# Altium project motor_driver499.PrjPcb
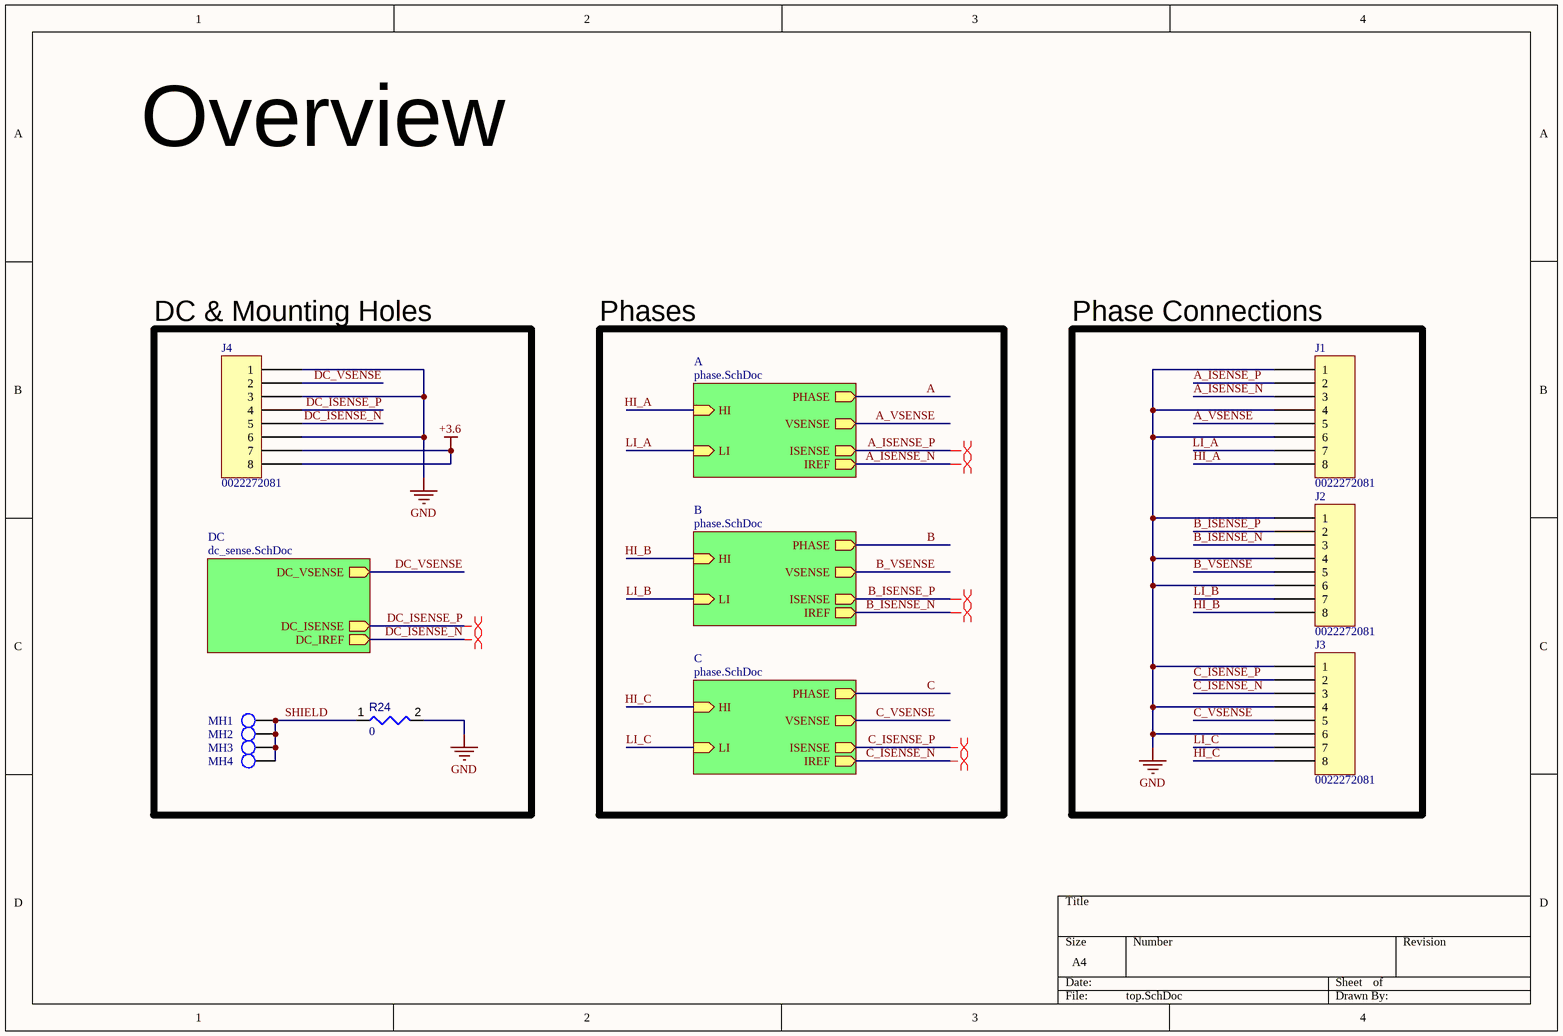
[diagram p0: top.SchDoc]
3 sheets, 121 parts. Net scope: hierarchical (ports join the sheet entries above them; power ports are global).
Board file: prototype_v1.PcbDoc
Sheets:
  top.SchDoc
    B = phase.SchDoc
    C = phase.SchDoc
    A = phase.SchDoc
    DC = dc_sense.SchDoc

## Sheet top.SchDoc
size A4; SheetNumber: 1; SheetTotal: 3

### Parts
J1  0022272081  [MOLEX KK 0022272081]
J2  0022272081  [MOLEX KK 0022272081]
J3  0022272081  [MOLEX KK 0022272081]
J4  0022272081  [MOLEX KK 0022272081]
MH1  Mounting Hole M2.5-Plated  [Copy of Mounting Hole 6-32-Footprint-1]  (value not drawn)
MH2  Mounting Hole M2.5-Plated  [Copy of Mounting Hole 6-32-Footprint-1]  (value not drawn)
MH3  Mounting Hole M2.5-Plated  [Copy of Mounting Hole 6-32-Footprint-1]  (value not drawn)
MH4  Mounting Hole M2.5-Plated  [Copy of Mounting Hole 6-32-Footprint-1]  (value not drawn)
R24  value 0  [RESC0603(1608)_L]  (hidden comment: 0R3J)

### Blocks framed on the sheet
DC & Mounting Holes: J4 MH1-MH4 R24
Phase Connections: J1-J3

### Sub-sheets
A = phase.SchDoc: HI (in), LI (in), PHASE (out), VSENSE (out), ISENSE (out), IREF (out)
B = phase.SchDoc: HI (in), LI (in), PHASE (out), VSENSE (out), ISENSE (out), IREF (out)
C = phase.SchDoc: HI (in), LI (in), PHASE (out), VSENSE (out), ISENSE (out), IREF (out)
DC = dc_sense.SchDoc: DC_VSENSE (out), DC_ISENSE (out), DC_IREF (out)

### Nets
+3.6: J4.7 J4.8
GND: J1.1 J1.4 J1.6 J2.1 J2.4 J2.6 J3.1 J3.4 J3.6 J4.1 J4.3 J4.6 R24.2
A_ISENSE_N: J1.3 ; sheet A/IREF
A_ISENSE_P: J1.2 ; sheet A/ISENSE
A_VSENSE: J1.5 ; sheet A/VSENSE
B_ISENSE_N: J2.3 ; sheet B/IREF
B_ISENSE_P: J2.2 ; sheet B/ISENSE
B_VSENSE: J2.5 ; sheet B/VSENSE
C_ISENSE_N: J3.3 ; sheet C/IREF
C_ISENSE_P: J3.2 ; sheet C/ISENSE
C_VSENSE: J3.5 ; sheet C/VSENSE
DC_ISENSE_N: J4.5 ; sheet DC/DC_IREF
DC_ISENSE_P: J4.4 ; sheet DC/DC_ISENSE  [project net DC_ISENSE]
DC_VSENSE: J4.2 ; sheet DC/DC_VSENSE
HI_A: J1.8 ; sheet A/HI
HI_B: J2.8 ; sheet B/HI
HI_C: J3.8 ; sheet C/HI
LI_A: J1.7 ; sheet A/LI
LI_B: J2.7 ; sheet B/LI
LI_C: J3.7 ; sheet C/LI
SHIELD: MH1.1 MH2.1 MH3.1 MH4.1 R24.1

### Layout directives
differential pair: A_ISENSE_N, A_ISENSE_P, B_ISENSE_N, B_ISENSE_P, C_ISENSE_N, C_ISENSE_P, DC_ISENSE, DC_ISENSE_N

### Notes on the sheet
- Overview
- Phases

### Library data of the parts
J1-J4 = CMP-002-00675-1: CONN HEADER VERT 8POS 2.54MM; Manufacturer: Molex; Contact Length - Mating: 0.295" (7.49mm); Contact Length - Post: 0.140" (3.56mm); Shrouding: Shrouded - 1 Wall; Style: Board to Cable/Wire; Number of Positions Loaded: All; Number of Positions: 8; Pitch - Mating: 0.100" (2.54mm); Overall Contact Length: 0.560" (14.22mm); Material Flammability Rating: UL94 V-0; Insulation Height: 0.461" (11.70mm); LastUpdated: 1/12/2020 11:52:41 PM; Connector Type: Header; ComponentLink2Description: DigiKey Link; ComponentLink2URL: http://digikey.com/product-detail/en/molex/0022272081/WM4117-ND/1130583; Part Number: 0022272081; Part Status: Active; ComponentLink1Description: Datasheet; Lifecycle Status: Active; PartId: 82; Contact Finish Thickness - Mating: 100.0µin (2.54µm); Number of Rows: 1; Series: KK 6410; Termination: Solder; Fastening Type: Friction Lock; Insulation Material: Polyamide (PA), Nylon; Contact Shape: Square; Minimum Order: 1; Packaging: Bulk; Price: 0.60; Insulation Color: Natural; Contact Type: Male Pin; Contact Material: Brass; Mounting Type: Through Hole; ComponentLink1URL: https://www.molex.com/pdm_docs/sd/022272081_sd.pdf; Contact Finish - Mating: Tin; Contact Finish - Post: Tin
MH1-MH4 = CMP-00028-00010-2
R24 = CMP-009-00063-2: Jumper 0603 (1608 Metric); Case/Package: 0603; Mounting Technology: SMT; Pins: 2

## Sheet phase.SchDoc
size A3; SheetNumber: 2; SheetTotal: 3
Used 3 times, as channels B, C, A. Parts and nets are listed once, with the designators drawn on the sheet.
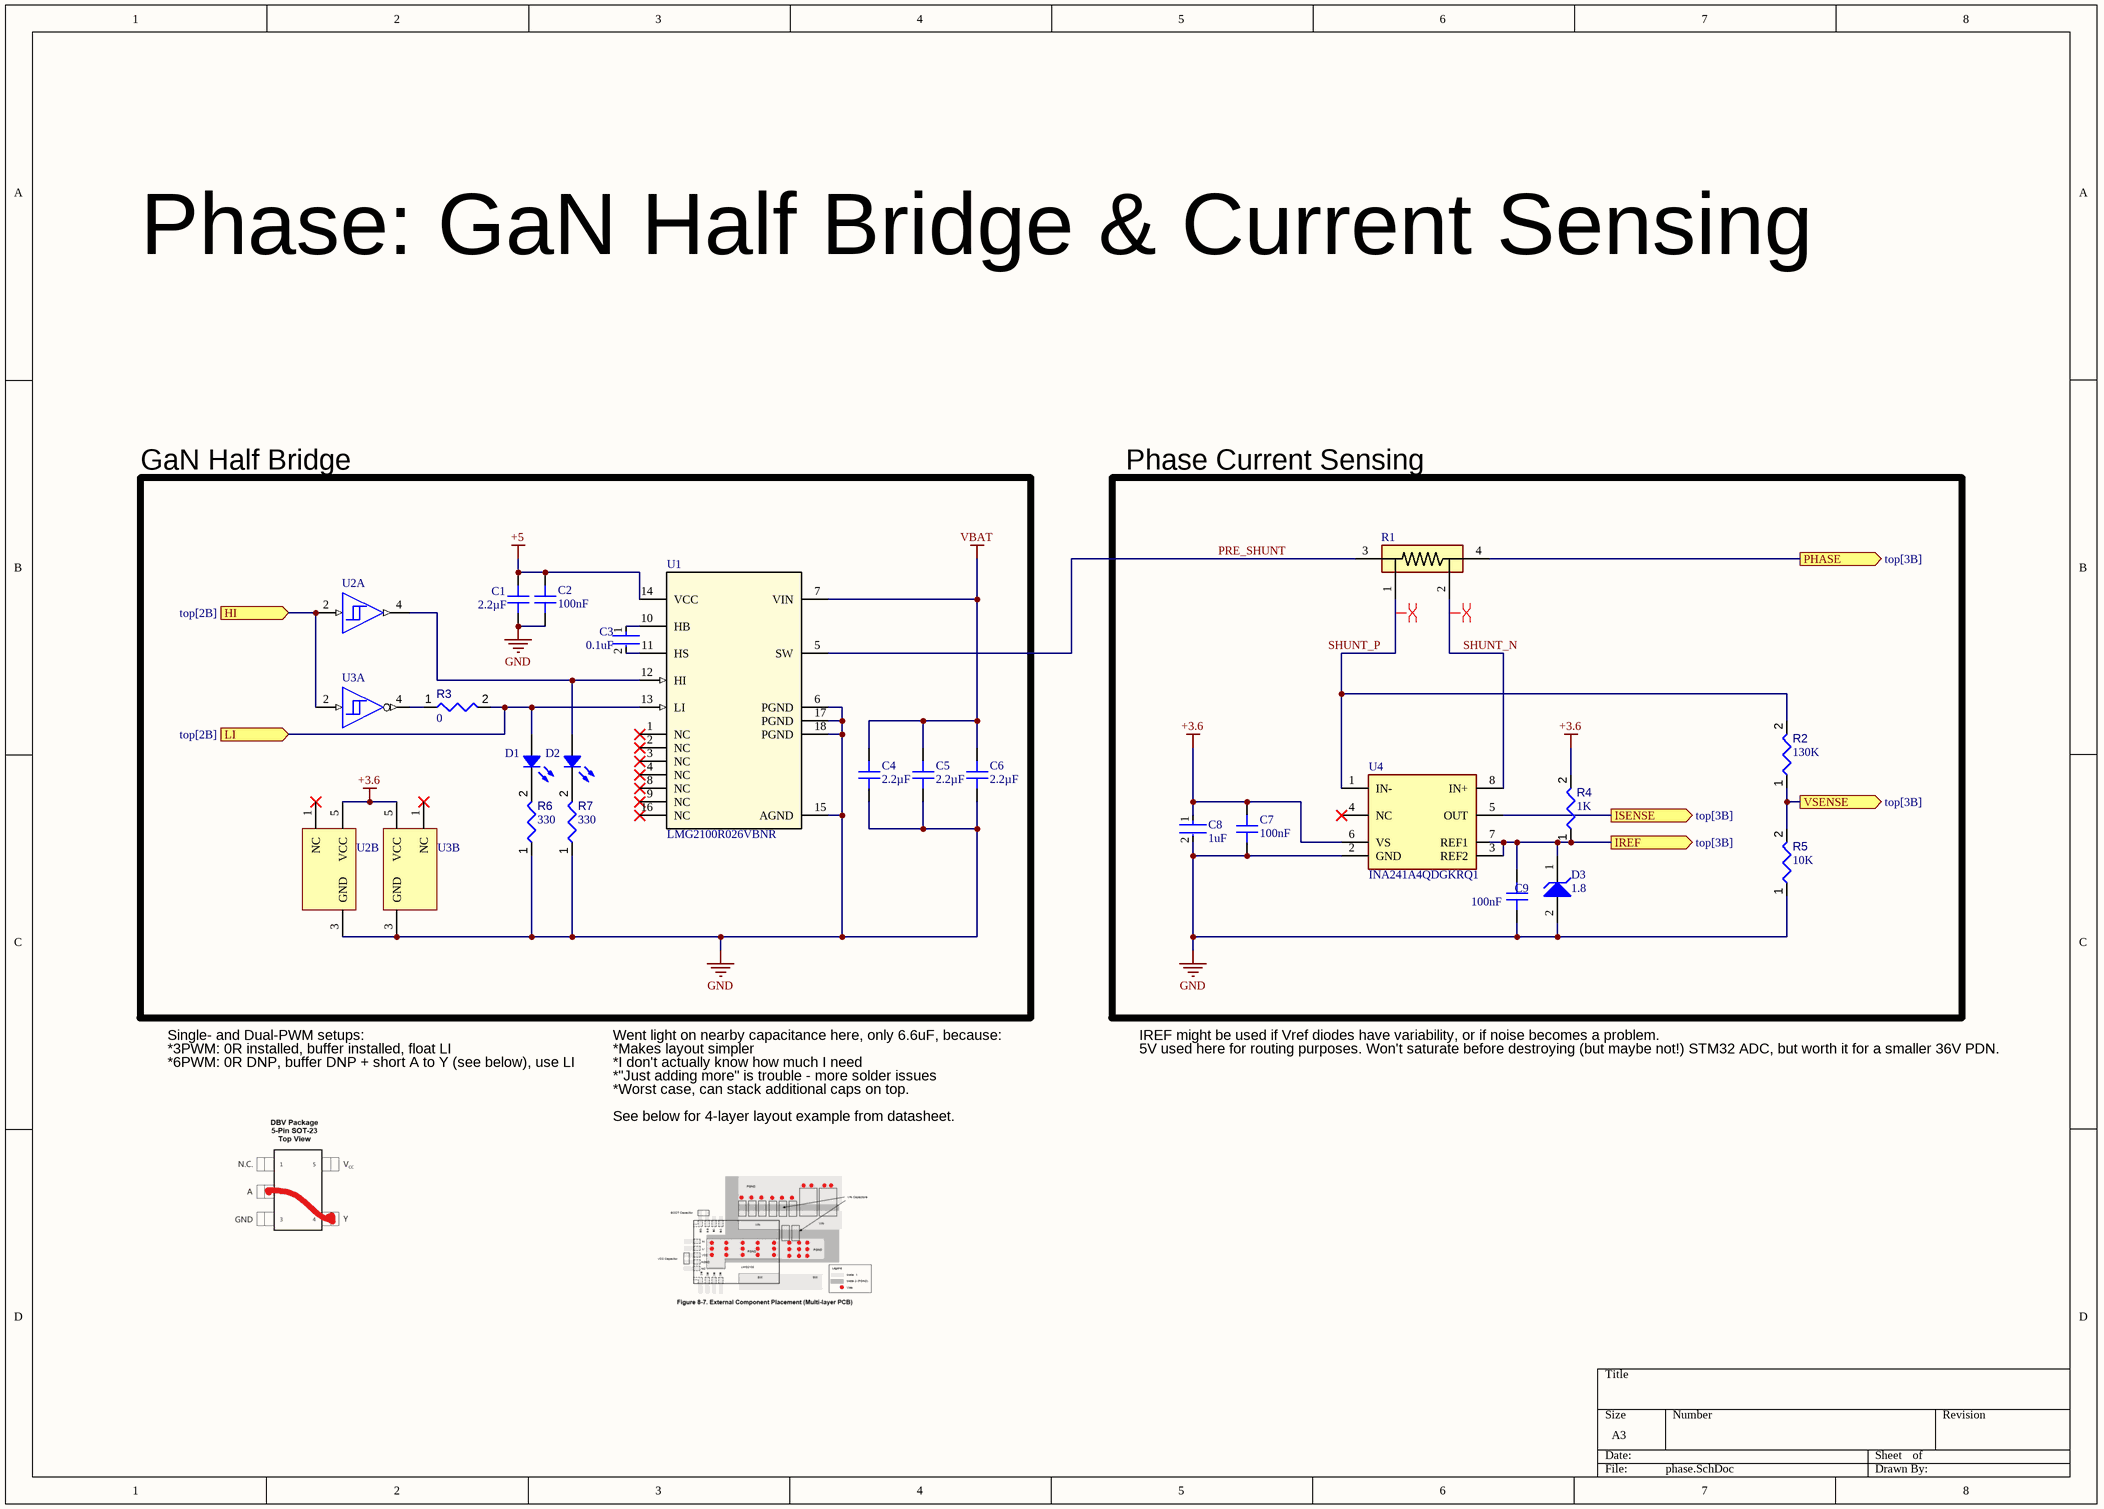
[diagram p1: phase.SchDoc]

### Parts
C1  value 2.2µF  [CAP 0603_1608]  (hidden comment: KGM15BR51C225KM)
C2  value 100nF  [CAPC0402(1005)33_L]  (hidden comment: CL05B104KO5NNNC)
C3  0.1uF  [FP-GRM155-0_05-MFG]
C4  value 2.2µF  [MURATA GRM21B 0805_2012]  (hidden comment: GRM21BD72A225ME01K)
C5  value 2.2µF  [MURATA GRM21B 0805_2012]  (hidden comment: GRM21BD72A225ME01K)
C6  value 2.2µF  [MURATA GRM21B 0805_2012]  (hidden comment: GRM21BD72A225ME01K)
C7  value 100nF  [CAPC0402(1005)33_L]  (hidden comment: CL05B104KO5NNNC)
C8  1uF  [FP-GRM155-0_05-MFG]
C9  value 100nF  [CAPC0402(1005)33_L]  (hidden comment: CL05B104KO5NNNC)
D1  150060BS55040  [LED 0603_1608 BLUE]  (value not drawn)
D2  150060BS55040  [LED 0603_1608 BLUE]  (value not drawn)
D3  VZ Typ (V): 1.8  [ONSC-SOD-123-2-425-04_V]  (hidden comment: SZMMSZ4678T1G)
R1  PU2726FKMPD0U3L  [PU2726FKMPD0U3L]  (value not drawn)
R2  value 130K  [RESC0603(1608)_L]  (hidden comment: 120R3J)
R3  value 0  [RESC0603(1608)_L]  (hidden comment: 0R3J)
R4  value 1K  [RESC0603(1608)_L]  (hidden comment: 120R3J)
R5  value 10K  [RESC0603(1608)_L]  (hidden comment: 120R3J)
R6  value 330  [RESC0603(1608)_L]  (hidden comment: 120R3J)
R7  value 330  [RESC0603(1608)_L]  (hidden comment: 120R3J)
U1  LMG2100R026VBNR  [VBN0018A-MFG]
U2  SN74AUP1G17DBVT  [DBV0005A_N]  (value not drawn)  (parts A,B of 2)
U3  SN74LVC1G14MDBVREP  [DBV0005A_N]  (value not drawn)  (parts A,B of 2)
U4  INA241A4QDGKRQ1  [SOIC127P600X175-8N]

### Blocks framed on the sheet
GaN Half Bridge: C1-C6 D1 D2 R3 R6 R7 U1-U3
Phase Current Sensing: C7-C9 D3 R1 R2 R4 R5 U4

### Ports
HI (in, see top[2B]), IREF (out, see top[3B]), ISENSE (out, see top[3B]), LI (in, see top[2B]), PHASE (out, see top[3B]), VSENSE (out, see top[3B])

### Nets
+3.6: C7.2 C8.1 R4.2 U2.5(VCC) U3.5(VCC) U4.6(VS)
+5: C1.2 C2.2 U1.14(VCC)
GND: C1.1 C2.1 C4.1 C5.1 C6.1 C7.1 C8.2 C9.1 D3.2(A) R5.1 R6.1 R7.1 U1.6(PGND) U1.15(AGND) U1.17(PGND) U1.18(PGND) U2.3(GND) U3.3(GND) U4.2(GND)
VBAT: C4.2 C5.2 C6.2 U1.7(VIN)
HI: U2.2(A) U3.2(A) ; port HI
IREF: C9.2 D3.1(K) R4.1 U4.3(REF2) U4.7(REF1) ; port IREF
ISENSE: U4.5(OUT) ; port ISENSE
LI: D1.1 R3.2 U1.13(LI) ; port LI
PHASE: R1.4 ; port PHASE
PRE_SHUNT: R1.3 U1.5(SW)
SHUNT_N: R1.2 U4.8(IN+)
SHUNT_P: R1.1 R2.2 U4.1(IN-)
VSENSE: R2.1 R5.2 ; port VSENSE
NetC3_1: C3.1 U1.10(HB)
NetC3_2: C3.2 U1.11(HS)
NetD1_2: D1.2 R6.2
NetD2_1: D2.1 U1.12(HI) U2.4(Y)
NetD2_2: D2.2 R7.2
NetR3_1: R3.1 U3.4(Y)

Not connected (* = marked no-connect by the designer): U1 1(NC)* 2(NC)* 3(NC)* 4(NC)* 8(NC)* 9(NC)* 16(NC)*; U2 1(NC)*; U3 1(NC)*; U4 4(NC)*

### Channels
B: designators end in _B; ports HI=HI_B IREF=B_ISENSE_N ISENSE=B_ISENSE_P LI=LI_B PHASE=B VSENSE=B_VSENSE
C: designators end in _C; ports HI=HI_C IREF=C_ISENSE_N ISENSE=C_ISENSE_P LI=LI_C PHASE=C VSENSE=C_VSENSE
A: designators end in _A; ports HI=HI_A IREF=A_ISENSE_N ISENSE=A_ISENSE_P LI=LI_A PHASE=A VSENSE=A_VSENSE

### Layout directives
differential pair: SHUNT_N_B, SHUNT_P_B

### Notes on the sheet
- Phase: GaN Half Bridge & Current Sensing
- Single- and Dual-PWM setups:
- *3PWM: 0R installed, buffer installed, float LI
- Went light on nearby capacitance here, only 6.6uF, because:
- *Makes layout simpler
- IREF might be used if Vref diodes have variability, or if noise becomes a problem.
- 5V used here for routing purposes. Won't saturate before destroying (but maybe not!) STM32 ADC, but worth it for a smaller 36V PDN.
- *6PWM: 0R DNP, buffer DNP + short A to Y (see below), use LI
- *I don't actually know how much I need
- *"Just adding more" is trouble - more solder issues
- *Worst case, can stack additional caps on top.
- See below for 4-layer layout example from datasheet.

### Library data of the parts
C1 = CMP-001-48803-2: CAP CER 2.2UF 16V X5R 0603; manufacturer: KYOCERA AVX; Tolerance: 10%; Part Number: KGM15BR51C225KM; series: KGM - X5R; lastupdated: 2/9/2024 8:09:11 PM; Size / Dimension: 0.063" L x 0.031" W (1.60mm x 0.80mm); ComponentLink2Description: DigiKey Link; Operating Temperature: -55°C ~ 85°C; ComponentLink1URL: https://datasheets.kyocera-avx.com/cx5r.pdf; Mounting Type: Surface Mount, MLCC; Part Status: Active; ComponentLink1Description: Datasheet; partid: 53097; Lifecycle Status: Active; price: 0.04; Device Package: 0603 (1608 Metric); Thickness (Max): 0.037" (0.95mm); Case/Package: 0603 (1608 Metric); packaging: TapeAndReel; Applications: General Purpose; ComponentLink2URL: https://www.digikey.com/en/products/detail/kyocera-avx/KGM15BR51C225KM/9749268; Temperature Coefficient: X5R; Voltage - Rated: 16V; Minimum Order: 1
C2 C7 C9 = CMP-001-35390-2: CAP CER 0.1UF 16V X7R 0402; manufacturer: Samsung Electro-Mechanics; Tolerance: 10%; ComponentLink2URL: https://www.digikey.com/en/products/detail/samsung-electro-mechanics/CL05B104KO5NNNC/3886659; Lifecycle Status: Active; lastupdated: 2/9/2024 8:04:31 PM; price: 0.01; Case/Package: 0402 (1005 Metric); series: CL; Mounting Type: Surface Mount, MLCC; ComponentLink1URL: http://www.samsungsem.com/kr/support/product-search/mlcc/CL05B104KO5NNNC.jsp; ComponentLink2Description: DigiKey Link; Part Status: Active; Part Number: CL05B104KO5NNNC; Thickness (Max): 0.022" (0.55mm); packaging: CutTape; Temperature Coefficient: X7R; Applications: General Purpose; Voltage - Rated: 16V; Device Package: 0402 (1005 Metric); Size / Dimension: 0.039" L x 0.020" W (1.00mm x 0.50mm); ComponentLink1Description: Datasheet; Operating Temperature: -55°C ~ 125°C; Minimum Order: 1; partid: 6066
C3 C8 = CMP-06035-012136-1: Chip Multilayer Ceramic Capacitors for General Purpose, 0402, 1.0uF, B, 10%, 20%, 16V
C4-C6 = CMP-001-56417-1: CAP CER 2.2UF 100V X7T 0805; manufacturer: Murata Electronics; Tolerance: 20%; Size / Dimension: 0.079" L x 0.049" W (2.00mm x 1.25mm); Lifecycle Status: Active; Voltage - Rated: 100V; ComponentLink1Description: Datasheet; Operating Temperature: -55°C ~ 125°C; partid: 45172; Applications: General Purpose; Thickness (Max): 0.057" (1.45mm); Temperature Coefficient: X7T; Part Number: GRM21BD72A225ME01K; price: 0.08; ComponentLink2URL: https://www.digikey.com/en/products/detail/murata-electronics/GRM21BD72A225ME01K/15972575; Mounting Type: Surface Mount, MLCC; packaging: TapeAndReel; lastupdated: 8/27/2024 9:29:54 AM; Case/Package: 0805 (2012 Metric); Minimum Order: 1; series: GRM; ComponentLink1URL: https://search.murata.co.jp/Ceramy/image/img/A01X/G101/ENG/GRM21BD72A225ME01-01A.pdf; Part Status: Active; ComponentLink2Description: DigiKey Link; Device Package: 0805 (2012 Metric)
D1 D2 = CMP-004-14535-2: LED BLUE DIFFUSED 0603 SMD; Manufacturer: Würth Elektronik; Current - Test: 20mA; Voltage - Forward (Vf) (Typ): 3.2V; Configuration: Standard; Lens Color: 0.50mm; Lens Style: Rectangle with Flat Top; Millicandela Rating: 80mcd; Lens Size: 1.00mm x 0.80mm; Viewing Angle: 140°; Wavelength - Peak: 465nm; Wavelength - Dominant: 470nm; LastUpdated: 6/3/2024 7:57:52 PM; Part Number: 150060BS55040; Color: Blue; Device Package: 0603 (1608 Metric); Lifecycle Status: Active; PartId: 796; Size / Dimension: 1.60mm L x 0.80mm W; Part Status: Active; ComponentLink1Description: Datasheet; Value: Blue; ComponentLink2URL: https://www.digikey.com/en/products/detail/würth-elektronik/150060BS55040/8557178; Height (Max): 0.50mm; ComponentLink1URL: https://www.we-online.de/web/en/index.php/download/media/07_electronic_components/download_center_1/application_notes_berichte/ano002_leds___the_future_of_horticultural_lighting/ANO002b_EN_LEDs_The_Future_of_Horticultural_Lighting.pdf; Series: WL-SMCD; Lens Transparency: Diffused; Case/Package: 0603 (1608 Metric); Mounting Type: Surface Mount; Packaging: TapeAndReel; Supplier Device Package: 0603 (1608 Metric); Price: 0.11; Minimum Order: 1; ComponentLink2Description: DigiKey Link
D3 = CMP-1060-00510-1: Zener Voltage Regulator, 500 mW, 2-Pin SOD-123, Pb-Free, Tape and Reel; Manufacturer: On Semiconductor; P Max (W): 0.5; PartNumber: SZMMSZ4678T1G; PackageDescription: 2-Pin SOD, Body 1.6 x 2.69 mm; Mounting Technology: Surface Mount; ComponentLink2URL: http://www.onsemi.com/pub_link/Collateral/MMSZ4678T1-D.PDF; ComponentLink1URL: http://www.onsemi.com/; DatasheetVersion: Rev. 9; PackageVersion: Rev. G, 10/2009; ComponentLink3Description: Package Specification; ComponentLink2Description: Datasheet; Packing: Tape and Reel; ComponentLink3URL: http://www.onsemi.com/pub_link/Collateral/425-04.PDF; RoHS: Pb-Free; PackageReference: SOD-123-2-425-04; ComponentLink1Description: Manufacturer URL
R1 = CMP-1021-000000-2: Thick Film Resistors - SMD 0.3mOhms 11W 2726 1% 75ppm Shunt AEC-Q200; Manufacturer_Name: Yageo Group; Geometry.Height: 3.7mm; Mouser Part Number: *; Datasheet Link: https://www.yageogroup.com/content/datasheet/asset/file/PYU-PU2726_ROHS_L; Arrow Price/Stock: *; Mouser Price/Stock: *; Manufacturer_Part_Number: PU2726FKMPD0U3L; Arrow Part Number: *; Source: PU2726FKMPD0U3L.SchLib; Design Item ID: PU2726FKMPD0U3L
R2 R4-R7 = CMP-009-00069-2: 120R 0.1W 5% 0603 (1608 Metric)  SMD; Power: 100mW; Mounting Technology: SMT; Tolerance: 5%; Case/Package: 0603; Pins: 2
R3 = CMP-009-00063-2: Jumper 0603 (1608 Metric); Case/Package: 0603; Mounting Technology: SMT; Pins: 2
U1 = CMP-1018-000000-3: 100V 2.6mOhm GaN half bridge module; Manufacturer_Name: Texas Instruments; TYPE: TYPE; Copyright: Copyright (C) 2025 Ultra Librarian. All rights reserved.; Manufacturer_Part_Number: LMG2100R026VBNR; Component Type: Standard; Design Item ID: LMG2100R026VBNR; Pin Count: 18; RefDes: RefDes; Source: LMG2100R026VBNR.SchLib
U2 = CMP-0859-00081-4: Low-Power Single Schmitt-Trigger Buffer, DBV0005A, SMALL T&R; Manufacturer: Texas Instruments; VCC(Max)(V): 3.6; Voltage(Nom)(V): 0.8,1.2,1.5,1.8,2.5,3.3; F @ Nom Voltage(Max)(Mhz): 100; Input Type: CMOS; VCC(Min)(V): 0.8; 3-State Output: No; Sub-Family: Non-Inverting Buffer/Driver; Rating: Catalog; Schmitt Trigger: Yes; Technology Family: AUP; tpd @ Nom Voltage(Max)(ns): 35.1,18.1,12.9,11,7.9,6.7; Logic: True; Bits(#): 1; Output Drive (IOL/IOH)(Max)(mA): 20/-20; ICC @ Nom Voltage(Max)(mA): 0.0009; DatasheetVersion: SCES579I; Generic Part Number: SN74AUP1G17; Operating Temperature Range(C): -40 to 85; Output Type: CMOS; PackageReference: DBV0005A
U3 = CMP-0859-00034-4: Enhanced Product Single Schmitt-Trigger Inverter, DBV0005A, LARGE T&R; Generic Part Number: SN74LVC1G14-EP; Manufacturer: Texas Instruments; tpd @ Nom Voltage(Max)(ns): 16,7.5,6,5; ICC @ Nom Voltage(Max)(mA): 0.019; Schmitt Trigger: Yes; Voltage(Nom)(V): 1.8,2.5,3.3,5; Sub-Family: Inverting Buffer/Driver; VCC(Max)(V): 5.5; Bits(#): 1; Logic: Inverting; 3-State Output: No; Rating: HiRel Enhanced Product; F @ Nom Voltage(Max)(Mhz): 150; VCC(Min)(V): 1.65; Input Type: CMOS/TTL; Technology Family: LVC; Output Drive (IOL/IOH)(Max)(mA): 32/-32; Output Type: CMOS; PackageReference: DBV0005A; DatasheetVersion: SCES674; Operating Temperature Range(C): -55 to 125
U4 = CMP-014-00010-2: Current Sense Amplifiers AEC-Q100, -4-V to 110-V bidirectional ultraprecise current sense amp with enhanced PWM rejection 8-VSSOP -40 to 125; Manufacturer_Name: Texas Instruments; Geometry.Height: 1.1mm; Mouser Price/Stock: https://www.mouser.co.uk/ProductDetail/Texas-Instruments/INA241A4QDGKRQ1?qs=HoCaDK9Nz5fDURPmL7Cdag%3D%3D; Mouser Part Number: 595-INA241A4QDGKRQ1; Datasheet Link: https://www.ti.com/lit/ds/symlink/ina241a-q1.pdf?ts=1710247494397&ref_url=https%253A%252F%252Fwww.ti.com%252Fproduct%252FINA241A-Q1%252Fpart-details%252FINA241A4QDGKRQ1; Source: INA241A4QDGKRQ1.SchLib; Design Item ID: INA241A4QDGKRQ1; Manufacturer_Part_Number: INA241A4QDGKRQ1

## Sheet dc_sense.SchDoc
size A3; SheetNumber: 3; SheetTotal: 3
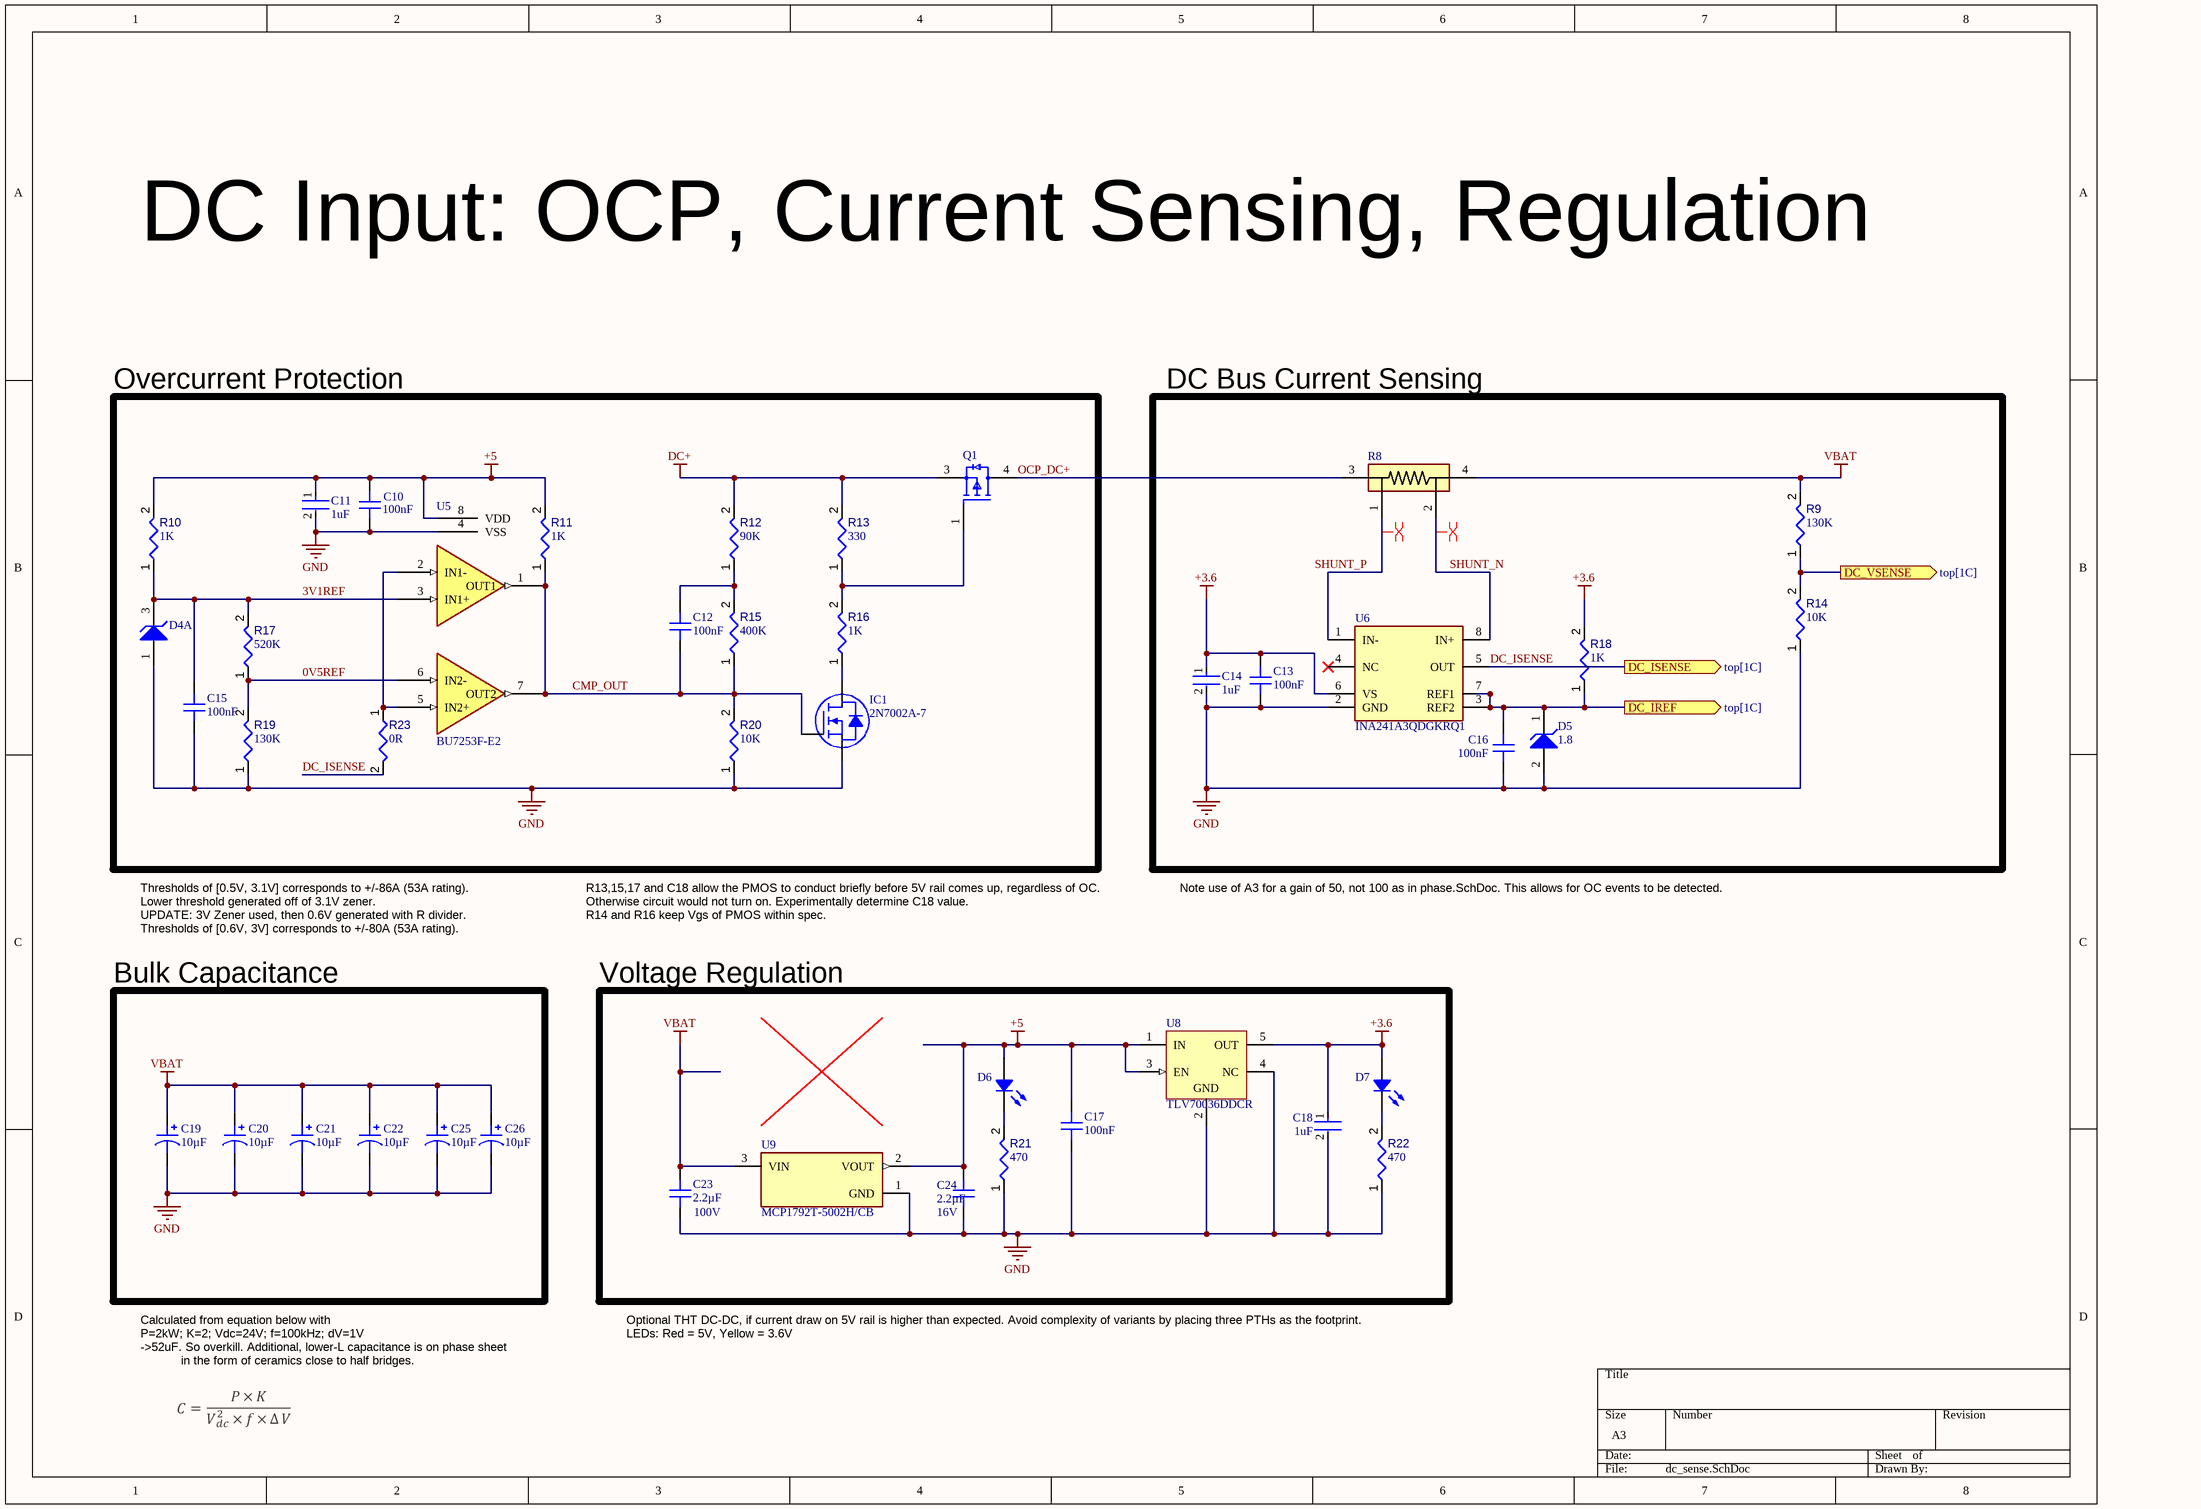
[diagram p2: dc_sense.SchDoc]

### Parts
C10  value 100nF  [CAPC0402(1005)33_L]  (hidden comment: CL05B104KO5NNNC)
C11  1uF  [FP-GRM155-0_05-MFG]
C12  value 100nF  [CAPC0402(1005)33_L]  (hidden comment: CL05B104KO5NNNC)
C13  value 100nF  [CAPC0402(1005)33_L]  (hidden comment: CL05B104KO5NNNC)
C14  1uF  [FP-GRM155-0_05-MFG]
C15  value 100nF  [CAPC0402(1005)33_L]  (hidden comment: CL05B104KO5NNNC)
C16  value 100nF  [CAPC0402(1005)33_L]  (hidden comment: CL05B104KO5NNNC)
C17  value 100nF  [CAPC0402(1005)33_L]  (hidden comment: CL05B104KO5NNNC)
C18  1uF  [FP-GRM155-0_05-MFG]
C19  value 10µF  [CAP ALSMD 8.3MM H10.5MM]  (hidden comment: UUX2A100MNL1GS)
C20  value 10µF  [CAP ALSMD 8.3MM H10.5MM]  (hidden comment: UUX2A100MNL1GS)
C21  value 10µF  [CAP ALSMD 8.3MM H10.5MM]  (hidden comment: UUX2A100MNL1GS)
C22  value 10µF  [CAP ALSMD 8.3MM H10.5MM]  (hidden comment: UUX2A100MNL1GS)
C23  value 2.2µF  Voltage - Rated: 100V  [CAP 1206_3216 - 0.8MM]  (hidden comment: AC1206KKX7R0BB225)
C24  value 2.2µF  Voltage - Rated: 16V  [CAP 0603_1608]  (hidden comment: KGM15BR51C225KM)
C25  value 10µF  [CAP ALSMD 8.3MM H10.5MM]  (hidden comment: UUX2A100MNL1GS)
C26  value 10µF  [CAP ALSMD 8.3MM H10.5MM]  (hidden comment: UUX2A100MNL1GS)
D4  SZBZX84C3V0ET1G  [ONSC-SOT-23-3-318-08_V]  (value not drawn)  (part A of 2)
D5  VZ Typ (V): 1.8  [ONSC-SOD-123-2-425-04_V]  (hidden comment: SZMMSZ4678T1G)
D6  150060BS55040  [LED 0603_1608 BLUE]  (value not drawn)
D7  150060BS55040  [LED 0603_1608 BLUE]  (value not drawn)
IC1  2N7002A-7  [DIODES SOT-23-3]
Q1  SQM100P10-19L_GE3  [FP-T13-0707-MFG]  (value not drawn)
R8  PU2726FKMPD0U3L  [PU2726FKMPD0U3L]  (value not drawn)
R9  value 130K  [RESC0603(1608)_L]  (hidden comment: 120R3J)
R10  value 1K  [RESC0603(1608)_L]  (hidden comment: 120R3J)
R11  value 1K  [RESC0603(1608)_L]  (hidden comment: 120R3J)
R12  value 90K  [RESC0603(1608)_L]  (hidden comment: 120R3J)
R13  value 330  [RESC0603(1608)_L]  (hidden comment: 120R3J)
R14  value 10K  [RESC0603(1608)_L]  (hidden comment: 120R3J)
R15  value 400K  [RESC0603(1608)_L]  (hidden comment: 120R3J)
R16  value 1K  [RESC0603(1608)_L]  (hidden comment: 120R3J)
R17  value 520K  [RESC0603(1608)_L]  (hidden comment: 120R3J)
R18  value 1K  [RESC0603(1608)_L]  (hidden comment: 120R3J)
R19  value 130K  [RESC0603(1608)_L]  (hidden comment: 120R3J)
R20  value 10K  [RESC0603(1608)_L]  (hidden comment: 120R3J)
R21  value 470  [RESC0603(1608)_L]  (hidden comment: 120R3J)
R22  value 470  [RESC0603(1608)_L]  (hidden comment: 120R3J)
R23  value 0R  [RESC0603(1608)_L]  (hidden comment: 120R3J)
U5  BU7253F-E2  [SOP8_ROM]
U6  INA241A3QDGKRQ1  [SOIC127P600X175-8N]
U8  TLV70036DDCR  [DDC0005A_L]
U9  MCP1792T-5002H/CB  [FP-C04-130-IPC_C]

### Blocks framed on the sheet
Overcurrent Protection: C10-C12 C15 D4 IC1 Q1 R10-R13 R15-R17 R19 R20 R23 U5
DC Bus Current Sensing: C13 C14 C16 D5 R8 R9 R14 R18 U6
Bulk Capacitance: C19-C22 C25 C26
Voltage Regulation: C17 C18 C23 C24 D6 D7 R21 R22 U8 U9

### Ports
DC_IREF (out, see top[1C]), DC_ISENSE (out, see top[1C]), DC_VSENSE (out, see top[1C])

### Nets
+3.6: C13.2 C14.1 C18.1 D7.1 R18.2 U6.6(VS) U8.5(OUT)
+5: C10.2 C11.1 C17.2 C24.2 D6.1 R10.2 R11.2 U5.8(VDD) U8.1(IN) U8.3(EN) U9.2(VOUT)
DC+: Q1.3(S) R12.2 R13.2
GND: C10.1 C11.2 C13.1 C14.2 C15.1 C16.1 C17.1 C18.2 C19.2 C20.2 C21.2 C22.2 C23.1 C24.1 C25.2 C26.2 D4.1(A) D5.2(A) IC1.2(S) R14.1 R19.1 R20.1 R21.1 R22.1 U5.4(VSS) U6.2(GND) U8.2(GND) U8.4(NC) U9.1(GND)
VBAT: C19.1 C20.1 C21.1 C22.1 C23.2 C25.1 C26.1 R8.4 R9.2 U9.3(VIN)
0V5REF: R17.1 R19.2 U5.6(IN2-)
3V1REF: C15.2 D4.3(K) R10.1 R17.2 U5.3(IN1+)
CMP_OUT: C12.1 IC1.1(G) R11.1 R15.1 R20.2 U5.1(OUT1) U5.7(OUT2)
DC_ISENSE: R23.2 U6.5(OUT) ; port DC_ISENSE
DC_ISENSE_N: C16.2 D5.1(K) R18.1 U6.3(REF2) U6.7(REF1) ; port DC_IREF
DC_VSENSE: R9.1 R14.2 ; port DC_VSENSE
OCP_DC+: Q1.4(D) R8.3
SHUNT_N: R8.2 U6.8(IN+)
SHUNT_P: R8.1 U6.1(IN-)
NetC12_2: C12.2 R12.1 R15.2
NetD6_2: D6.2 R21.2
NetD7_2: D7.2 R22.2
NetIC1_3: IC1.3(D) R16.1
NetQ1_1: Q1.1(G) R13.1 R16.2
NetR23_1: R23.1 U5.2(IN1-) U5.5(IN2+)

Not connected (* = marked no-connect by the designer): U6 4(NC)*

### Layout directives
differential pair: SHUNT_N, SHUNT_P

### Notes on the sheet
- DC Input: OCP, Current Sensing, Regulation
- Thresholds of [0.5V, 3.1V] corresponds to +/-86A (53A rating).
- Lower threshold generated off of 3.1V zener.
- UPDATE: 3V Zener used, then 0.6V generated with R divider.
- R13,15,17 and C18 allow the PMOS to conduct briefly before 5V rail comes up, regardless of OC.
- Otherwise circuit would not turn on. Experimentally determine C18 value.
- R14 and R16 keep Vgs of PMOS within spec.
- Note use of A3 for a gain of 50, not 100 as in phase.SchDoc. This allows for OC events to be detected.
- Thresholds of [0.6V, 3V] corresponds to +/-80A (53A rating).
- Calculated from equation below with
- Optional THT DC-DC, if current draw on 5V rail is higher than expected. Avoid complexity of variants by placing three PTHs as the footprint.
- P=2kW; K=2; Vdc=24V; f=100kHz; dV=1V
- ->52uF. So overkill. Additional, lower-L capacitance is on phase sheet
- in the form of ceramics close to half bridges.
- LEDs: Red = 5V, Yellow = 3.6V

### Library data of the parts
C10 C12 C13 C15-C17 = CMP-001-35390-2: as C2 on sheet phase; ComponentLink2URL: https://www.digikey.com/en/products/detail/samsung-electro-mechanics/CL05B104KO5NNNC/3886659; Lifecycle Status: Active; lastupdated: 2/9/2024 8:04:31 PM; price: 0.01; Case/Package: 0402 (1005 Metric); series: CL; Mounting Type: Surface Mount, MLCC; ComponentLink1URL: http://www.samsungsem.com/kr/support/product-search/mlcc/CL05B104KO5NNNC.jsp; ComponentLink2Description: DigiKey Link; Part Status: Active; Part Number: CL05B104KO5NNNC; Thickness (Max): 0.022" (0.55mm); packaging: CutTape; Temperature Coefficient: X7R; Applications: General Purpose; Voltage - Rated: 16V; Device Package: 0402 (1005 Metric); Size / Dimension: 0.039" L x 0.020" W (1.00mm x 0.50mm); ComponentLink1Description: Datasheet; Operating Temperature: -55°C ~ 125°C; Minimum Order: 1; partid: 6066
C11 C14 C18 = CMP-06035-012136-1: as C3 on sheet phase
C19-C22 C25 C26 = CMP-001-00511-1: CAP ALUM 10UF 20% 100V SMD; manufacturer: Nichicon; Polarization: Polar; Surface Mount Land Size: 0.327" L x 0.327" W (8.30mm x 8.30mm); Ripple Current @ Low Frequency: 75 mA @ 120 Hz; Lifetime @ Temp.: 2000 Hrs @ 105°C; Ripple Current @ High Frequency: 125.25 mA @ 10 kHz; Operating Temperature: -55°C ~ 105°C; price: 0.12; Case/Package: Radial, Can - SMD; Mounting Type: Surface Mount; Lifecycle Status: Active; Applications: General Purpose; lastupdated: 6/3/2024 8:15:48 PM; ComponentLink1Description: Datasheet; series: UUX; packaging: TapeAndReel; Tolerance: 20%; Minimum Order: 1; partid: 7531; Voltage - Rated: 100V; ComponentLink2URL: https://www.digikey.com/en/products/detail/nichicon/UUX2A100MNL1GS/2550555; Part Status: Active; ComponentLink1URL: http://nichicon-us.com/english/products/pdfs/e-uux.pdf; ComponentLink2Description: DigiKey Link; Height - Seated (Max): 0.413" (10.50mm); Device Package: Radial, Can - SMD; Part Number: UUX2A100MNL1GS; Size / Dimension: 0.315" Dia (8.00mm)
C23 = CMP-001-64876-1: CAP CER 2.2UF 100V X7R 1206; manufacturer: Yageo; Tolerance: 10%; price: 0.31; ComponentLink1URL: https://www.yageo.com/upload/media/product/productsearch/datasheet/mlcc/UPY-AC_HiCap_X7R_0.pdf; partid: 52346; Thickness (Max): 0.071" (1.80mm); Mounting Type: Surface Mount, MLCC; Ratings: AEC-Q200; ComponentLink1Description: Datasheet; ComponentLink2URL: https://www.digikey.com/en/products/detail/yageo/AC1206KKX7R0BB225/16797723; Operating Temperature: -55°C ~ 125°C; series: AC; lastupdated: 6/4/2024 7:10:05 PM; Temperature Coefficient: X7R; Size / Dimension: 0.126" L x 0.063" W (3.20mm x 1.60mm); Device Package: 1206 (3216 Metric); Part Number: AC1206KKX7R0BB225; ComponentLink2Description: DigiKey Link; Lifecycle Status: Active; Applications: Automotive; Minimum Order: 1; Case/Package: 1206 (3216 Metric); Part Status: Active; packaging: TapeAndReel
C24 = CMP-001-48803-2: as C1 on sheet phase; Part Number: KGM15BR51C225KM; series: KGM - X5R; lastupdated: 2/9/2024 8:09:11 PM; Size / Dimension: 0.063" L x 0.031" W (1.60mm x 0.80mm); ComponentLink2Description: DigiKey Link; Operating Temperature: -55°C ~ 85°C; ComponentLink1URL: https://datasheets.kyocera-avx.com/cx5r.pdf; Mounting Type: Surface Mount, MLCC; Part Status: Active; ComponentLink1Description: Datasheet; partid: 53097; Lifecycle Status: Active; price: 0.04; Device Package: 0603 (1608 Metric); Thickness (Max): 0.037" (0.95mm); Case/Package: 0603 (1608 Metric); packaging: TapeAndReel; Applications: General Purpose; ComponentLink2URL: https://www.digikey.com/en/products/detail/kyocera-avx/KGM15BR51C225KM/9749268; Temperature Coefficient: X5R; Minimum Order: 1
D4 = CMP-1060-01187-1: Zener Voltage Regulator, 225 mW, 3-Pin SOT-23, Pb-Free, Tape and Reel; Manufacturer: On Semiconductor; PackageReference: SOT-23-3-318-08; ComponentLink1Description: Manufacturer URL; ComponentLink3URL: http://www.onsemi.cn/pub_link/Collateral/318-08.PDF; Packing: Tape and Reel; ComponentLink3Description: Package Specification; RoHS: Pb-Free; ComponentLink2Description: Datasheet; PackageDescription: 3-Pin Small Outline Transistor, Body 2.92 x 1.3 mm, Pitch 0.95 mm; DatasheetVersion: Rev. 8; PackageVersion: Rev. AP, 11/2009; ComponentLink1URL: http://www.onsemi.com/; Mounting Technology: Surface Mount; ComponentLink2URL: http://www.onsemi.com/pub_link/Collateral/BZX84C2V4ET1-D.PDF; PartNumber: SZBZX84C3V0ET1G
D5 = CMP-1060-00510-1: as D3 on sheet phase; PartNumber: SZMMSZ4678T1G; PackageDescription: 2-Pin SOD, Body 1.6 x 2.69 mm; Mounting Technology: Surface Mount; ComponentLink2URL: http://www.onsemi.com/pub_link/Collateral/MMSZ4678T1-D.PDF; ComponentLink1URL: http://www.onsemi.com/; DatasheetVersion: Rev. 9; PackageVersion: Rev. G, 10/2009; ComponentLink3Description: Package Specification; ComponentLink2Description: Datasheet; Packing: Tape and Reel; ComponentLink3URL: http://www.onsemi.com/pub_link/Collateral/425-04.PDF; RoHS: Pb-Free; PackageReference: SOD-123-2-425-04; ComponentLink1Description: Manufacturer URL
D6 D7 = CMP-004-14535-2: as D1 on sheet phase; LastUpdated: 6/3/2024 7:57:52 PM; Part Number: 150060BS55040; Color: Blue; Device Package: 0603 (1608 Metric); Lifecycle Status: Active; PartId: 796; Size / Dimension: 1.60mm L x 0.80mm W; Part Status: Active; ComponentLink1Description: Datasheet; Value: Blue; ComponentLink2URL: https://www.digikey.com/en/products/detail/würth-elektronik/150060BS55040/8557178; Height (Max): 0.50mm; ComponentLink1URL: https://www.we-online.de/web/en/index.php/download/media/07_electronic_components/download_center_1/application_notes_berichte/ano002_leds___the_future_of_horticultural_lighting/ANO002b_EN_LEDs_The_Future_of_Horticultural_Lighting.pdf; Series: WL-SMCD; Lens Transparency: Diffused; Case/Package: 0603 (1608 Metric); Mounting Type: Surface Mount; Packaging: TapeAndReel; Supplier Device Package: 0603 (1608 Metric); Price: 0.11; Minimum Order: 1; ComponentLink2Description: DigiKey Link
IC1 = CMP-031-01263-1: MOSFET N-CH 60V 180MA SOT23; Manufacturer: Diodes Incorporated; Current - Continuous Drain (Id) @ 25°C: 180mA (Ta); Drive Voltage (Max Rds On,  Min Rds On): 5V, 10V; Input Capacitance (Ciss) (Max) @ Vds: 23 pF @ 25 V; Power Dissipation (Max): 370mW (Ta); FET Type: N-Channel; Vgs(th) (Max) @ Id: 2V @ 250µA; Vgs (Max): ±20V; Rds On (Max) @ Id, Vgs: 6Ohm @ 115mA, 5V; Lifecycle Status: Active; Minimum Order: 1; Case/Package: TO-236-3, SC-59, SOT-23-3; Supplier Device Package: SOT-23-3; Part Status: Active; Operating Temperature: -55°C ~ 150°C (TJ); ComponentLink1Description: Datasheet; Series: -; Price: 0.03; ComponentLink2Description: DigiKey Link; Technology: MOSFET (Metal Oxide); ComponentLink1URL: https://www.diodes.com/assets/Datasheets/ds31360.pdf; Packaging: TapeAndReel; ComponentLink2URL: https://www.digikey.com/en/products/detail/diodes-incorporated/2N7002A-7/3451498; Part Number: 2N7002A-7; Mounting Type: Surface Mount; Drain to Source Voltage (Vdss): 60 V; LastUpdated: 6/3/2024 8:15:17 PM
Q1 = CMP-02550-000324-1: MOSFET P-CH 100V 93A TO263
R8 = CMP-1021-000000-2: as R1 on sheet phase; Mouser Part Number: *; Datasheet Link: https://www.yageogroup.com/content/datasheet/asset/file/PYU-PU2726_ROHS_L; Arrow Price/Stock: *; Mouser Price/Stock: *; Manufacturer_Part_Number: PU2726FKMPD0U3L; Arrow Part Number: *; Source: PU2726FKMPD0U3L.SchLib; Design Item ID: PU2726FKMPD0U3L
R9-R23 = CMP-009-00069-2: as R2 on sheet phase; Mounting Technology: SMT; Tolerance: 5%; Case/Package: 0603; Pins: 2
U5 = CMP-059-000001-3: Comparator, Open Drain, 5V; Mfr_Name: ROHM Semiconductor; Type: Type; Design Item ID: BU7253F-E2; RefDes: RefDes; Source: BU7253F-E2.SchLib
U6 = CMP-014-00011-1: Current Sense Amplifiers AEC-Q100, -4-V to 110-V bidirectional ultraprecise current sense amp with enhanced PWM rejection 8-VSSOP -40 to 125; Manufacturer_Name: Texas Instruments; Geometry.Height: 1.1mm; Manufacturer_Part_Number: INA241A3QDGKRQ1; Datasheet Link: https://www.ti.com/lit/ds/symlink/ina241a-q1.pdf?ts=1710247494397&ref_url=https%253A%252F%252Fwww.ti.com%252Fproduct%252FINA241A-Q1%252Fpart-details%252FINA241A4QDGKRQ1; Mouser Part Number: 595-INA241A3QDGKRQ1; Source: INA241A4QDGKRQ1.SchLib; Design Item ID: INA241A3QDGKRQ1; Mouser Price/Stock: https://www.mouser.co.uk/ProductDetail/Texas-Instruments/INA241A3QDGKRQ1?qs=HoCaDK9Nz5fDURPmL7Cdag%3D%3D
U8 = CMP-0394-01051-2: Single Output LDO, 200 mA, Fixed 3.6 V Output, 2 to 5.5 V Input, with Low IQ, 5-pin SOT (DDC), -40 to 125 degC, Green (RoHS & no Sb/Br); Manufacturer: Texas Instruments; Vout Adj(Max)(V): 3.6; Vin(Min)(V): 2; Iout(Max)(A): 0.2; Iq(Typ)(mA): 0.03; Vin(Max)(V): 5.5; Vdo(Typ)(mV): 175; SubFamily: Single Channel LDO; ComponentLink1Description: Manufacturer URL; Vout Adj(Min)(V): 3.6; DatasheetVersion: SLVSA00D; Mounting Technology: Surface Mount; ComponentLink2Description: Datasheet; ComponentLink3URL: http://www.ti.com/litv/pdf/mpds123d; ComponentLink3Description: Package Specification; Eco-Plan: Green (RoHS & no Sb/Br); PackageReference: DDC0005A; ComponentLink1URL: http://www.ti.com/; ComponentLink2URL: http://www.ti.com/general/docs/lit/getliterature.tsp?genericPartNumber=TLV70036&fileType=pdf; PackageDescription: 5-Pin Plastic Small Outline, Body 2.9 x 1.6 mm, 0.95 mm Pitch; Code_JEDEC: MO-193; PackageVersion: 4204403-2/E; Fixed Output Options(V): 3.6; Accuracy(%): 2; PartNumber: TLV70036DDCR
U9 = CMP-06324-000131-1: IC REG LINEAR 5V 100MA SOT23A-3; Max Supply Current: 150uA; Power Supply Rejection Ratio (PSRR): 55dB; Max Input Voltage: 55V; Number of Regulators: 1; Output Configuration: Positive; Output Type: Fixed; Quiescent Current: 45uA; Case/Package: TO-236-3; Max Operating Temperature: 150°C; Min Operating Temperature: -40°C; RoHS Compliant: Yes; Output Current: 100mA; Series: Automotive, AEC-Q100; Mount: Surface Mount; Min Output Voltage: 5V

## Nets that join several sheets
+3.6: top (J4.7 J4.8), B (6 pins), C (6 pins), A (6 pins), dc_sense (7 pins)
+5: B (C1_B.2 C2_B.2 U1_B.14), C (C1_C.2 C2_C.2 U1_C.14), A (C1_A.2 C2_A.2 U1_A.14), dc_sense (11 pins)
GND: top (13 pins), B (19 pins), C (19 pins), A (19 pins), dc_sense (29 pins)
VBAT: B (C4_B.2 C5_B.2 C6_B.2 U1_B.7), C (C4_C.2 C5_C.2 C6_C.2 U1_C.7), A (C4_A.2 C5_A.2 C6_A.2 U1_A.7), dc_sense (10 pins)
A_ISENSE_N: top (J1.3), A (5 pins)
A_ISENSE_P: top (J1.2), A (U4_A.5)
A_VSENSE: top (J1.5), A (R2_A.1 R5_A.2)
B_ISENSE_N: top (J2.3), B (5 pins)
B_ISENSE_P: top (J2.2), B (U4_B.5)
B_VSENSE: top (J2.5), B (R2_B.1 R5_B.2)
C_ISENSE_N: top (J3.3), C (5 pins)
C_ISENSE_P: top (J3.2), C (U4_C.5)
C_VSENSE: top (J3.5), C (R2_C.1 R5_C.2)
DC_ISENSE: top (J4.4), dc_sense (R23.2 U6.5)
DC_ISENSE_N: top (J4.5), dc_sense (5 pins)
DC_VSENSE: top (J4.2), dc_sense (R9.1 R14.2)
HI_A: top (J1.8), A (U2_A.2 U3_A.2)
HI_B: top (J2.8), B (U2_B.2 U3_B.2)
HI_C: top (J3.8), C (U2_C.2 U3_C.2)
LI_A: top (J1.7), A (D1_A.1 R3_A.2 U1_A.13)
LI_B: top (J2.7), B (D1_B.1 R3_B.2 U1_B.13)
LI_C: top (J3.7), C (D1_C.1 R3_C.2 U1_C.13)

## Assembly variants
Variant of motor_driver499: all parts fitted